# Altium schematic sheet MainSheet.SchDoc: Main
size A; SheetNumber: 1; SheetTotal: 3
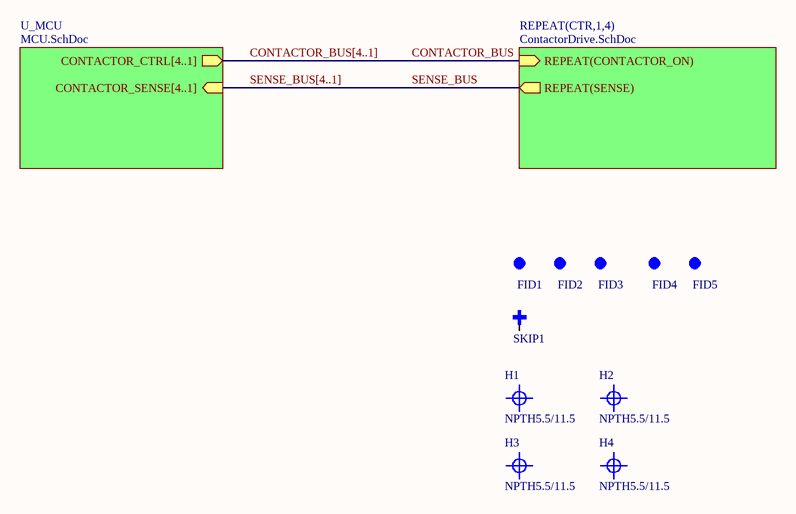
[diagram p0: MainSheet.SchDoc]

## Parts
FID1  FIDUCIAL  [FID08]  (value not drawn)
FID2  FIDUCIAL  [FID08]  (value not drawn)
FID3  FIDUCIAL  [FID08]  (value not drawn)
FID4  FIDUCIAL  [FID08]  (value not drawn)
FID5  FIDUCIAL  [FID08]  (value not drawn)
H1  NPTH5.5/11.5  [NPTH5.5/11.5]  (no BOM)
H2  NPTH5.5/11.5  [NPTH5.5/11.5]  (no BOM)
H3  NPTH5.5/11.5  [NPTH5.5/11.5]  (no BOM)
H4  NPTH5.5/11.5  [NPTH5.5/11.5]  (no BOM)
SKIP1  X-Out/Skip Mark  [SKIP20-NOCOPPER]  (value not drawn)

## Sub-sheets
REPEAT(CTR,1,4) = ContactorDrive.SchDoc: REPEAT(CONTACTOR_ON) (in), REPEAT(SENSE) (out)
U_MCU = MCU.SchDoc: CONTACTOR_SENSE[4..1] (in), CONTACTOR_CTRL[4..1] (out)

## Nets
CONTACTOR_BUS: sheet REPEAT(CTR,1,4)/REPEAT(CONTACTOR_ON)
SENSE_BUS: sheet REPEAT(CTR,1,4)/REPEAT(SENSE)

Not connected (* = marked no-connect by the designer): SKIP1 1

## Buses and harness runs
bus CONTACTOR_BUS[4..1] = sheet U_MCU/CONTACTOR_CTRL[4..1]
bus SENSE_BUS[4..1] = sheet U_MCU/CONTACTOR_SENSE[4..1]

## Notes on the sheet
- Revision History
- Rev:
- Description:
- Date:
- Title
- Size:
- Drawn By:
- D
- Number:
- Revision:
- Sheet
- of
- File:

## Library data of the parts
FID1-FID5 = FIDUCIAL: Alignment fiducial
H1-H4 = NPTH5.5/11.5: 5.5mm diameter hole, 11.5mm soldermask opening
SKIP1 = SKIP: X-Out/Skip Mark for bad board/do not populate